# EAGLE design p128a (EAGLE 9.6.2)
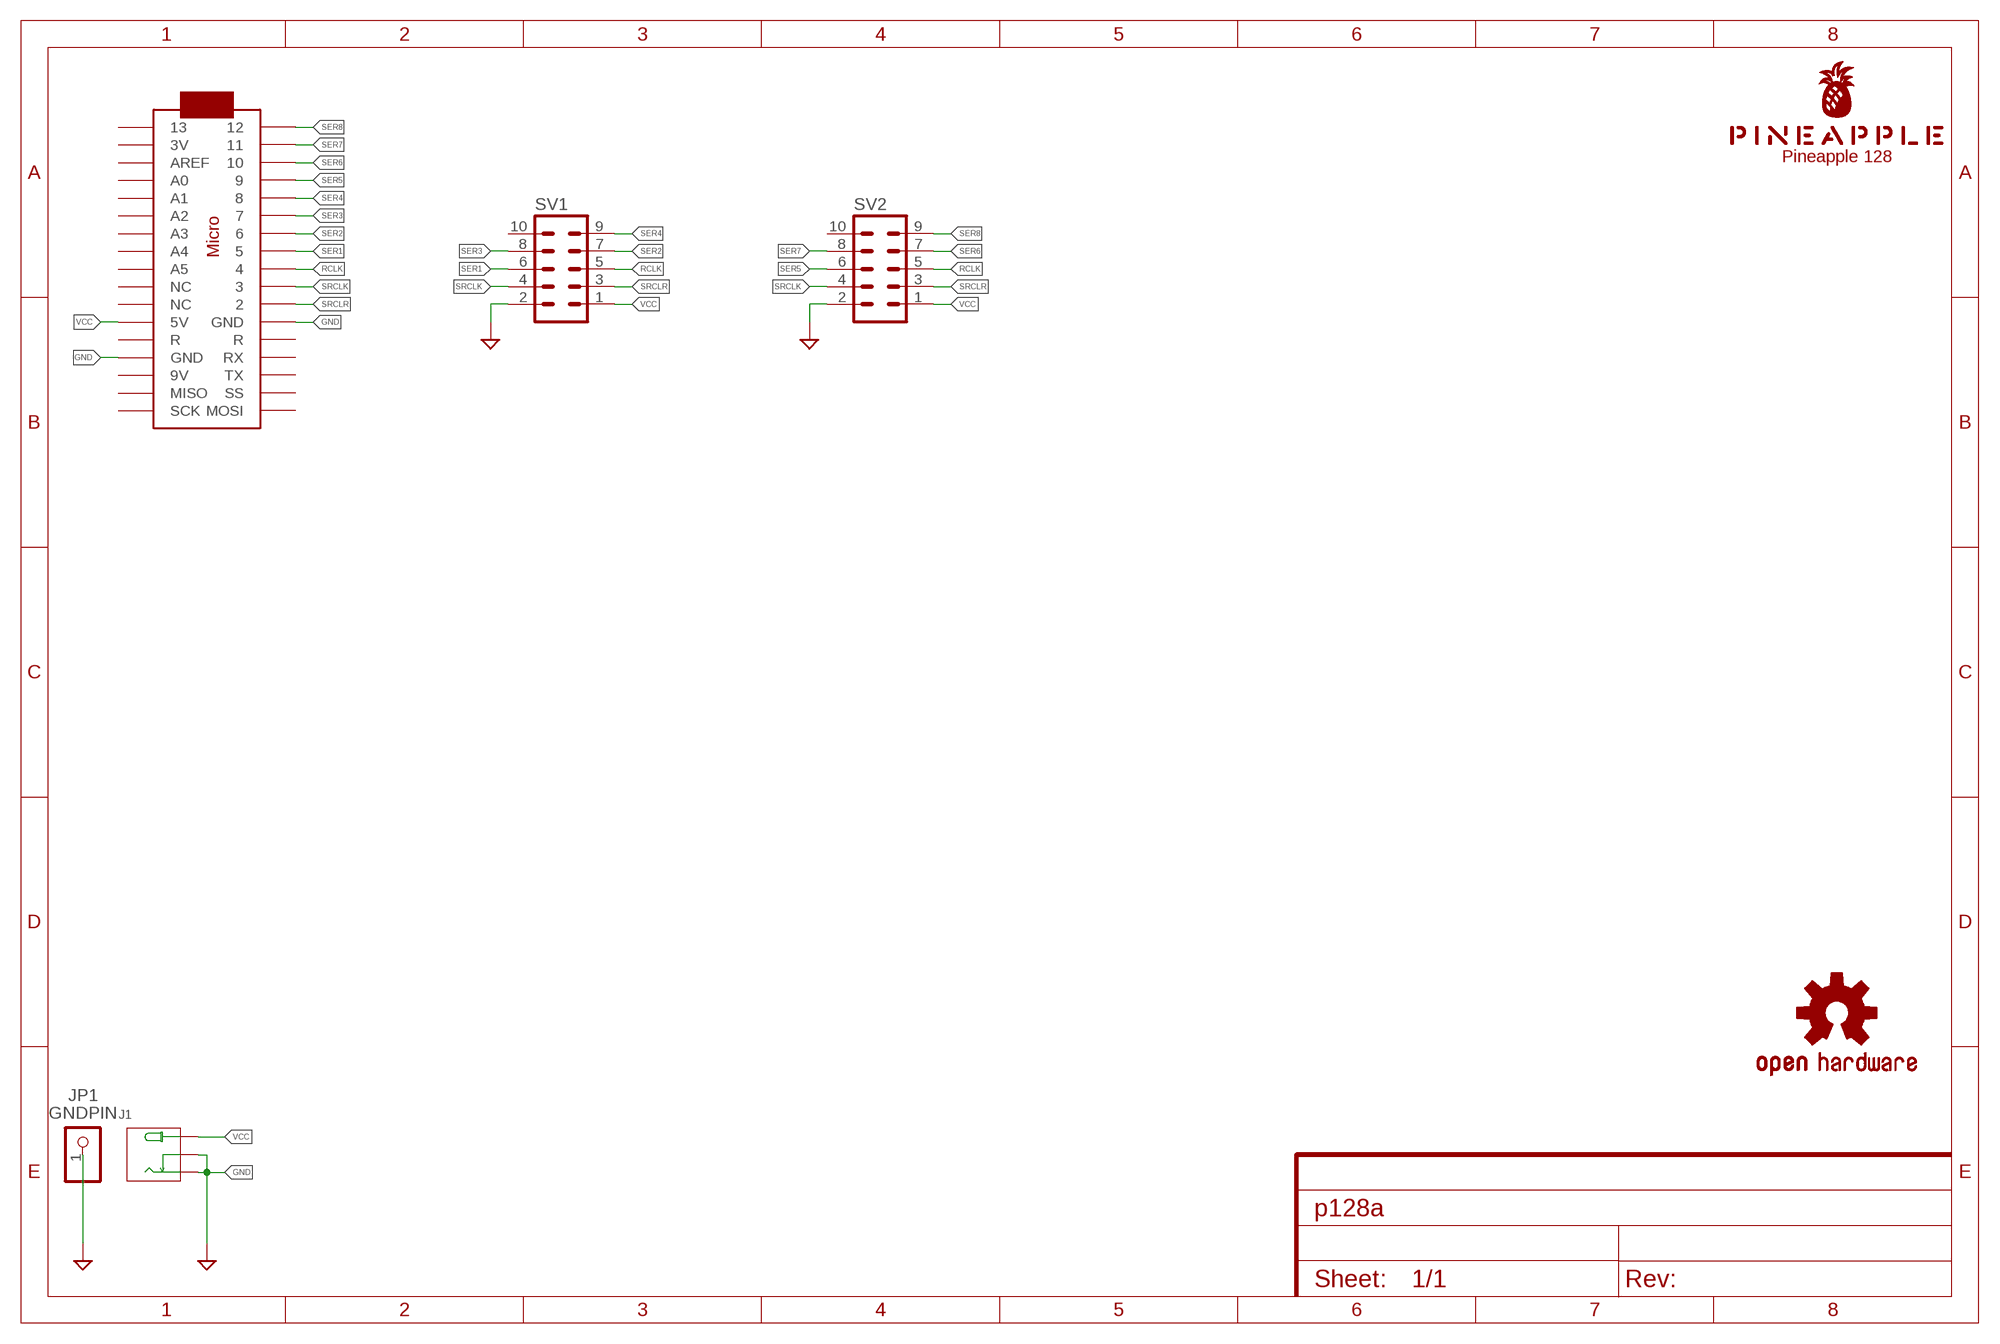
[diagram p0: schematic, sheet 1]

## Parts
J1  JACK-DC-005'DC-005'  [3P-L14.2*W11.0*H9.0MM]
JP1  GNDPIN  PINHD-1X1  [1X01]
LOGO1  OSHW-LOGOS-COPPER  [OSHW-LOGO-S_COPPER]
MC1  ARDUINOMICRO  [ARDUINOMICRO]
SV1  ML10L  [ML10L]
SV2  ML10L  [ML10L]
U$1  PINEAPPLE450_SILK  [PINEAPPLE450_SILK]

## Nets
GND [gnd]: J1.-1(-) J1.-2(CDN) JP1.1 MC1.P$12(GND) MC1.P$21(GND) SV1.2 SV2.2
RCLK: MC1.P$9 SV1.5 SV2.5
SER1: MC1.P$8 SV1.6
SER2: MC1.P$7 SV1.7
SER3: MC1.P$6 SV1.8
SER4: MC1.P$5 SV1.9
SER5: MC1.P$4 SV2.6
SER6: MC1.P$3 SV2.7
SER7: MC1.P$2 SV2.8
SER8: MC1.P$1 SV2.9
SRCLK: MC1.P$10 SV1.4 SV2.4
SRCLR: MC1.P$11 SV1.3 SV2.3
VCC [power]: J1.+ MC1.P$23(5V) SV1.1 SV2.1
Unconnected: MC1.P$13(R) MC1.P$14(RX) MC1.P$15(TX) MC1.P$16(SS) MC1.P$17(MOSI) MC1.P$18(SCK) MC1.P$19(MISO) MC1.P$20(9V) MC1.P$22(R) MC1.P$24(NC) MC1.P$25(NC) MC1.P$26(A5) MC1.P$27(A4) MC1.P$28(A3) MC1.P$29(A2) MC1.P$30(A1) MC1.P$31(A0) MC1.P$32(AREF) MC1.P$33(3V) MC1.P$34 SV1.10 SV2.10

## Notes on the sheet
- Pineapple 128

## Library data of the parts
J1 = Seeed-Connector:JACK-DC-005: 320120003
JP1 = pinhead:PINHD-1X1: PIN HEADER
LOGO1 = SparkFun-Aesthetics:OSHW-LOGO: Open-Source Hardware (OSHW) Logo This logo indicates the piece of hardware it is found on incorporates a OSHW license and/or adheres to the definition of open source hardware found here: http://freedomdefined.org/OSHW
MC1 = adafruit:ARDUINOMICRO
SV1 SV2 = con-ml:ML10L: HARTING; OC_FARNELL: unknown; OC_NEWARK: unknown
U$1 = pineapple:PINEAPPLE450_SILK

## Net classes
0 default: width 0.152 mm, drill 0.152 mm, clearance 0.152 mm
1 gnd: width 0.61 mm, drill 0.152 mm, clearance 0.152 mm
2 power: width 0.61 mm, drill 0.152 mm, clearance 0.152 mm
3 analog: width 0.305 mm, drill 0.152 mm, clearance 0.152 mm

## Board
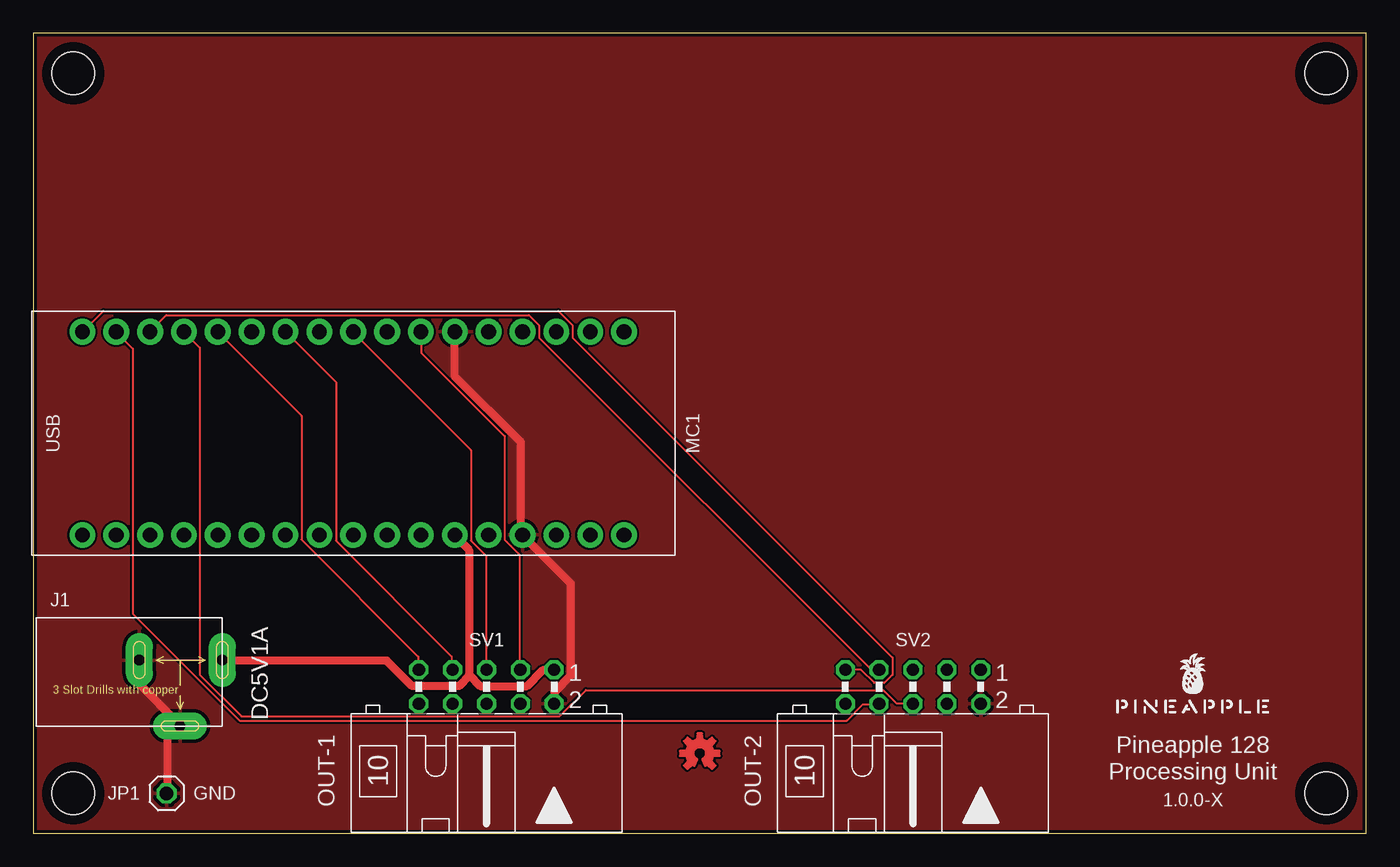
[diagram p1: board, top side]
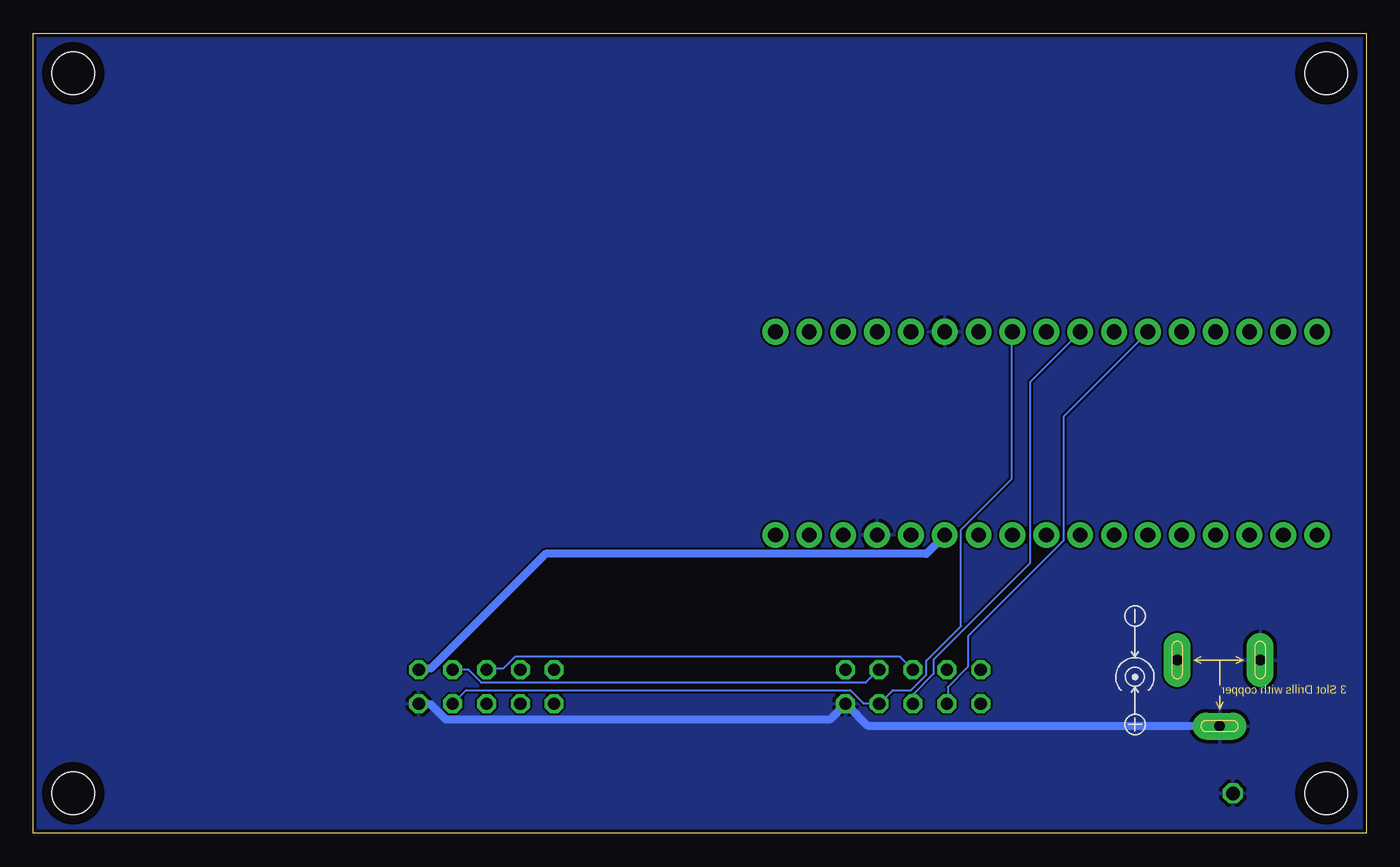
[diagram p2: board, bottom side, seen from below]

Size 100 x 60 mm. Coordinates in mm from the lower left corner, seen from the top.
Outline: 0,0 100,0 100,60 0,60 0,0
Copper layers (1*16): Top 0.035mm / dielectric 1.5mm / Bottom 0.035mm
Design rules "SeeedStudio_2layer_DRU_no_angle_20140221": minimum track width 6mil, minimum drill 12mil, track to track 6mil, track to pad 6mil, pad to pad 6mil, via to via 6mil, smd to smd 0mil, copper to edge 10mil, drill to drill 10mil, minimum pad ring 10mil, minimum via ring 6mil, stop-mask expansion 2mil, vias tented up to drill 100mil, thermal gap 10mil
Holes 3.2 mm at 3,3 97,3 97,57 3,57
tRestrict: area 0.8,54.8 to 5.2,59.2; area 94.8,54.8 to 99.2,59.2; area 0.8,0.8 to 5.2,5.2; area 94.8,0.8 to 99.2,5.2
bRestrict: area 0.8,0.8 to 5.2,5.2; area 94.8,0.8 to 99.2,5.2; area 94.8,54.8 to 99.2,59.2; area 0.8,54.8 to 5.2,59.2

### Footprints (pad centres in the part's own frame; a part is rotated, then mirrored left to right if it is on the bottom)
3P-L14.2*W11.0*H9.0MM = drill 0.813 pad 2.032 long: + 3.175,0; -1 -3.048,0; -2 0,-4.953
1X01 = drill 1.016 octagon: 1 0,0
ARDUINOMICRO = drill 1.1 pad 1.93: P$1 -20.32,7.62; P$2 -17.78,7.62; P$3 -15.24,7.62; P$4 -12.7,7.62; P$5 -10.16,7.62; P$6 -7.62,7.62; P$7 -5.08,7.62; P$8 -2.54,7.62; P$9 0,7.62; P$10 2.54,7.62; P$11 5.08,7.62; P$12 12.7,-7.62; P$13 10.16,-7.62; P$14 12.7,7.62; P$15 15.24,7.62; P$16 17.78,7.62; P$17 20.32,7.62; P$18 20.32,-7.62; P$19 17.78,-7.62; P$20 15.24,-7.62; P$21 7.62,7.62; P$22 10.16,7.62; P$23 7.62,-7.62; P$24 5.08,-7.62; P$25 2.54,-7.62; P$26 0,-7.62; P$27 -2.54,-7.62; P$28 -5.08,-7.62; P$29 -7.62,-7.62; P$30 -10.16,-7.62; P$31 -12.7,-7.62; P$32 -15.24,-7.62; P$33 -17.78,-7.62; P$34 -20.32,-7.62
ML10L = drill 0.914 octagon: 1 -5.08,-1.27; 2 -5.08,1.27; 3 -2.54,-1.27; 4 -2.54,1.27; 5 0,-1.27; 6 0,1.27; 7 2.54,-1.27; 8 2.54,1.27; 9 5.08,-1.27; 10 5.08,1.27

### Placement (x,y rotation side)
J1  11,13 0 top
JP1  10,3 0 top
LOGO1  50,6 0 top
MC1  24,30 0 top
SV1  34,11 180 top
SV2  66,11 180 top
U$1  87,9 0 top

### Tracks (layer width: path | path; a pad name or v marks a point on that pad's centre or on a via)
GND
  Top 0.61: JP1.1 10.06,3.05 10.06,7.09 10.97,8 J1.-2 10.82,8.31 8,11.12 8,12.95 J1.-1 | SV1.2 39.09,9.75 39.09,10.59 40.31,11.81 40.31,18.75 36.73,22.33 MC1.P$12 36.58,22.63 36.58,29.34 31.62,34.29 31.62,37.57 MC1.P$21
  Bottom 0.61: SV2.2 71.02,9.68 70.18,9.68 69.04,8.53 40.23,8.53 39.09,9.68 SV1.2 38.86,9.53 37.41,8.08 11.05,8.08 J1.-2
  pour Top: -1,-1 101,-1 101,61 -1,61
  pour Bottom: -2,-2 102,-2 102,62 -2,62
RCLK
  Top 0.152: SV1.5 33.98,12.34 33.98,20.8 32.84,21.95 32.84,28.73 24,37.57 MC1.P$9
  Bottom 0.152: SV2.5 65.99,12.34 64.77,12.34 63.86,13.26 34.98,13.26 34.06,12.34 SV1.5
SER1
  Bottom 0.152: SV1.6 33.98,9.75 33.98,10.44 32.46,11.96 32.46,13.03 25.22,20.27 25.22,33.83 21.49,37.57 MC1.P$8
SER2
  Top 0.152: SV1.7 31.39,12.34 31.39,13.26 22.71,21.95 22.71,33.83 18.97,37.57 MC1.P$7
SER3
  Bottom 0.152: SV1.8 31.39,9.75 31.39,10.97 29.87,12.5 29.87,14.78 22.71,21.95 22.71,31.24 16.38,37.57 MC1.P$6
SER4
  Top 0.152: SV1.9 28.88,12.34 28.88,13.26 20.12,22.02 20.12,31.32 13.87,37.57 MC1.P$5
SER5
  Top 0.152: SV2.6 65.99,9.75 64.77,9.75 63.78,10.74 41.45,10.74 39.47,8.76 15.62,8.76 12.5,11.89 12.5,36.42 11.35,37.57 MC1.P$4
SER6
  Top 0.152: SV2.7 63.4,12.34 62.79,12.34 37.95,37.19 37.95,38.1 37.19,38.86 9.98,38.86 8.76,37.64 MC1.P$3
SER7
  Top 0.152: SV2.8 63.4,9.68 62.26,9.68 61.04,8.46 15.47,8.46 7.47,16.46 7.47,36.35 6.25,37.57 MC1.P$2
SER8
  Top 0.152: SV2.9 60.96,12.27 62.1,12.27 63.09,11.28 63.86,11.28 64.47,11.89 64.47,13.18 40.46,37.19 40.46,38.1 39.4,39.17 5.26,39.17 3.73,37.64 MC1.P$1
SRCLK
  Bottom 0.152: SV2.4 68.5,9.75 67.51,10.74 38.71,10.74 37.72,9.75 36.58,9.75 SV1.4 36.5,9.75 35.51,10.74 34.14,10.74 32.99,11.89 32.99,12.95 30.4,15.54 30.4,22.78 26.59,26.59 26.59,37.57 MC1.P$10
SRCLR
  Top 0.152: SV1.3 36.5,12.34 36.5,20.88 35.36,22.02 35.36,29.79 29.11,36.04 29.11,37.57 MC1.P$11
  Bottom 0.152: SV2.3 68.5,12.27 67.36,12.27 66.37,11.28 37.57,11.28 36.58,12.27 SV1.3
VCC
  Top 0.61: 32.73,11.85 32.69,11.89 32.69,21.26 31.62,22.33 MC1.P$23 | 32.73,11.85 33.53,11.05 37.03,11.05 38.25,12.27 39.01,12.27 SV1.1 | 32.73,11.85 31.93,11.05 28.42,11.05 26.52,12.95 14.25,12.95 J1.+
  Bottom 0.61: SV2.1 71.02,12.34 70.18,12.34 61.57,20.95 32.99,20.95 31.62,22.33 MC1.P$23

### Text on the board
tNames: USB | MC1 | DC5V1A | Pineapple 128 | Processing Unit | GND | OUT-1 | OUT-2 | 1.0.0-X